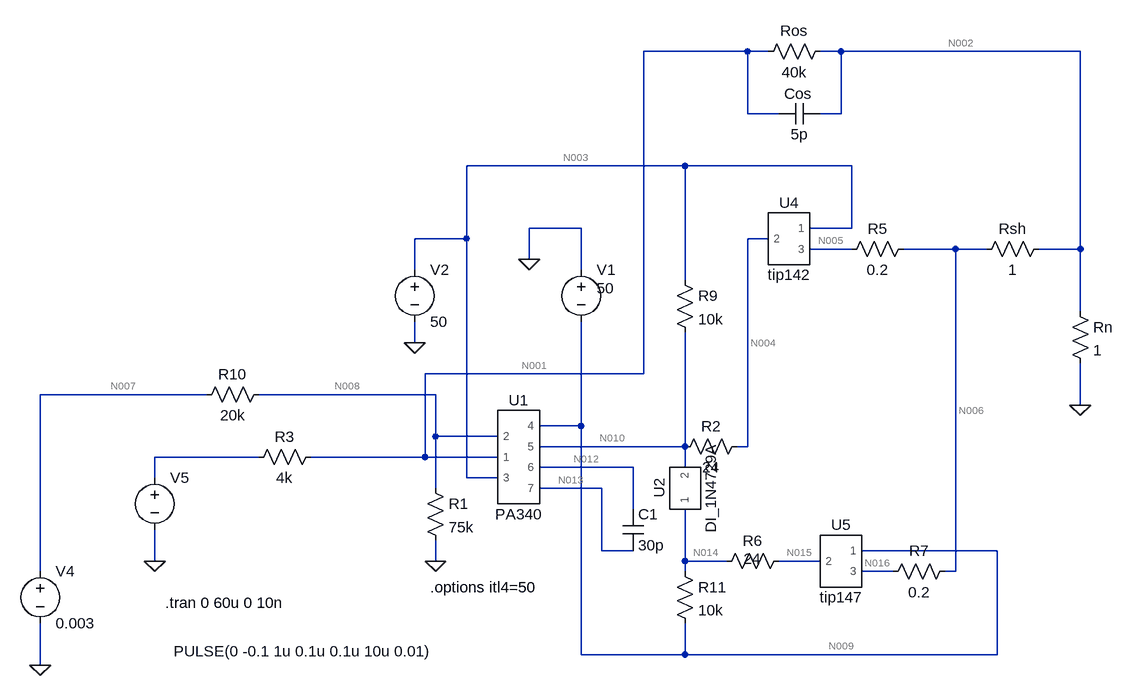
[diagram p0: schematic Draft17.asc]
Draft17.asc, the LTspice schematic file:
Version 4
SHEET 1 1672 680
WIRE 544 -464 384 -464
WIRE 576 -464 544 -464
WIRE 688 -464 656 -464
WIRE 1056 -464 688 -464
WIRE 544 -368 544 -464
WIRE 592 -368 544 -368
WIRE 688 -368 688 -464
WIRE 688 -368 656 -368
WIRE 448 -288 112 -288
WIRE 704 -288 448 -288
WIRE 288 -192 208 -192
WIRE 704 -192 704 -288
WIRE 704 -192 640 -192
WIRE 112 -176 112 -288
WIRE 112 -176 32 -176
WIRE 576 -176 544 -176
WIRE 704 -160 640 -160
WIRE 864 -160 784 -160
WIRE 912 -160 864 -160
WIRE 1056 -160 1056 -464
WIRE 1056 -160 992 -160
WIRE 208 -144 208 -192
WIRE 32 -128 32 -176
WIRE 288 -128 288 -192
WIRE 448 -112 448 -288
WIRE 1056 -64 1056 -160
WIRE 32 -16 32 -48
WIRE 384 32 384 -464
WIRE 384 32 48 32
WIRE -288 64 -544 64
WIRE 64 64 -208 64
WIRE 1056 80 1056 16
WIRE 288 112 288 -48
WIRE 288 112 224 112
WIRE 64 128 64 64
WIRE 160 128 64 128
WIRE 448 144 448 -32
WIRE 448 144 224 144
WIRE 544 144 544 -176
WIRE 544 144 528 144
WIRE -208 160 -368 160
WIRE 48 160 48 32
WIRE 48 160 -128 160
WIRE 160 160 48 160
WIRE 368 176 224 176
WIRE 448 176 448 144
WIRE -368 192 -368 160
WIRE 112 192 112 -176
WIRE 160 192 112 192
WIRE 64 208 64 128
WIRE 320 208 224 208
WIRE 368 240 368 176
WIRE 320 304 320 208
WIRE 368 304 320 304
WIRE 928 304 720 304
WIRE -368 320 -368 272
WIRE 64 320 64 288
WIRE 448 320 448 240
WIRE 512 320 448 320
WIRE 656 320 592 320
WIRE -544 336 -544 64
WIRE 448 336 448 320
WIRE 768 336 720 336
WIRE 864 336 864 -160
WIRE 864 336 848 336
WIRE 288 464 288 112
WIRE 448 464 448 416
WIRE 448 464 288 464
WIRE 928 464 928 304
WIRE 928 464 448 464
WIRE -544 480 -544 416
FLAG 32 -16 0
FLAG 208 -144 0
FLAG -544 480 0
FLAG 1056 80 0
FLAG -368 320 0
FLAG 64 320 0
SYMBOL PA340 192 160 R0
SYMATTR InstName U1
SYMBOL res 48 192 R0
SYMATTR InstName R1
SYMATTR Value 75k
SYMBOL res 544 128 R90
WINDOW 0 0 56 VBottom 2
WINDOW 3 32 56 VTop 2
SYMATTR InstName R2
SYMATTR Value 24
SYMBOL res -112 144 R90
WINDOW 0 0 56 VBottom 2
WINDOW 3 32 56 VTop 2
SYMATTR InstName R3
SYMATTR Value 4k
SYMBOL cap 352 240 R0
SYMATTR InstName C1
SYMATTR Value 30p
SYMBOL voltage 288 -144 R0
WINDOW 3 24 44 Left 2
WINDOW 123 0 0 Left 0
WINDOW 39 0 0 Left 0
SYMATTR Value 50
SYMATTR InstName V1
SYMBOL voltage 32 -144 R0
WINDOW 123 0 0 Left 0
WINDOW 39 0 0 Left 0
SYMATTR InstName V2
SYMATTR Value 50
SYMBOL res 1040 -80 R0
SYMATTR InstName Rn
SYMATTR Value 1
SYMBOL res 672 -480 R90
WINDOW 0 0 56 VBottom 2
WINDOW 3 32 56 VTop 2
SYMATTR InstName Ros
SYMATTR Value 40k
SYMBOL cap 656 -384 R90
WINDOW 0 1 34 VBottom 2
WINDOW 3 32 32 VTop 2
SYMATTR InstName Cos
SYMATTR Value 5p
SYMBOL res -192 48 R90
WINDOW 0 0 56 VBottom 2
WINDOW 3 32 56 VTop 2
SYMATTR InstName R10
SYMATTR Value 20k
SYMBOL voltage -368 176 R0
WINDOW 123 0 0 Left 0
WINDOW 39 0 0 Left 0
WINDOW 3 29 283 Left 2
SYMATTR Value PULSE(0 -0.1 1u 0.1u 0.1u 10u 0.01)
SYMATTR InstName V5
SYMBOL res 608 304 R90
WINDOW 0 0 56 VBottom 2
WINDOW 3 28 56 VBottom 2
SYMATTR InstName R6
SYMATTR Value 24
SYMBOL voltage -544 320 R0
WINDOW 123 0 0 Left 0
WINDOW 39 0 0 Left 0
SYMATTR InstName V4
SYMATTR Value 0.003
SYMBOL tip142 608 -176 R0
SYMATTR InstName U4
SYMBOL tip147 688 320 R0
SYMATTR InstName U5
SYMBOL res 800 -176 R90
WINDOW 0 0 56 VBottom 2
WINDOW 3 32 56 VTop 2
SYMATTR InstName R5
SYMATTR Value 0.2
SYMBOL res 864 320 R90
WINDOW 0 0 56 VBottom 2
WINDOW 3 32 56 VTop 2
SYMATTR InstName R7
SYMATTR Value 0.2
SYMBOL res 432 -128 R0
SYMATTR InstName R9
SYMATTR Value 10k
SYMBOL res 432 320 R0
SYMATTR InstName R11
SYMATTR Value 10k
SYMBOL DI_1N4729A 448 208 R270
SYMATTR InstName U2
SYMBOL res 1008 -176 R90
WINDOW 0 0 56 VBottom 2
WINDOW 3 32 56 VTop 2
SYMATTR InstName Rsh
SYMATTR Value 1
TEXT -352 384 Left 2 !.tran 0 60u 0 10n
TEXT 56 360 Left 2 !.options itl4=50

The netlist it stands for:
* Draft17.asc
XU1 N008 N001 N003 N009 N010 N012 N013 PA340  ; pins 2 1 3 4 5 6 7
R1 N008 0 75k
R2 N004 N010 24
R3 N001 N011 4k
C1 N012 N013 30p
V1 0 N009 50
V2 N003 0 50
Rn N002 0 1
Ros N002 N001 40k
Cos N002 N001 5p
R10 N008 N007 20k
V5 N011 0 PULSE(0 -0.1 1u 0.1u 0.1u 10u 0.01)
R6 N015 N014 24
V4 N007 0 0.003
XU4 N003 N004 N005 tip142  ; pins 1 2 3
XU5 N009 N015 N016 tip147  ; pins 1 2 3
R5 N006 N005 0.2
R7 N006 N016 0.2
R9 N003 N010 10k
R11 N014 N009 10k
XU2 N014 N010 DI_1N4729A  ; pins 1 2
Rsh N002 N006 1
.tran 0 60u 0 10n
.options itl4=50
.lib PA340_Pspice.LIB
.lib TIP142.cir
.lib TIP147.cir
.lib 1N4729A.cir
.backanno
.end

* Results of the author's LTspice run, read from the files saved beside the schematic
* Operating Point, zero values left out:
*   V(n003) = 50 V
*   V(n009) = -50 V
*   V(n012) = -1.9 mV
*   V(n013) = 2.375 V
*   V(n010) = 2.333 V
*   V(n001) = 14.39 mV
*   V(n008) = 2.368 mV
*   V(n004) = 2.321 V
*   V(n002) = 158.3 mV
*   V(n007) = 3 mV
*   V(n015) = -988.3 mV
*   V(n014) = -992.5 mV
*   V(n005) = 350.5 mV
*   V(n016) = 314.4 mV
*   V(n006) = 316.6 mV
*   I(Rsh) = -158.3 mA
*   I(R11) = 4.901 mA
*   I(R9) = 4.767 mA
*   I(R7) = 11.03 mA
*   I(R5) = -169.3 mA
*   I(R6) = 173.4 µA
*   I(R10) = -31.62 nA
*   I(Ros) = 3.598 µA
*   I(Rn) = 158.3 mA
*   I(R3) = 3.597 µA
*   I(R2) = -517.9 µA
*   I(R1) = 31.57 nA
*   I(V4) = -31.62 nA
*   I(V5) = 3.597 µA
*   I(V2) = -176 mA
*   I(V1) = -17.74 mA
*   Ix(u1:2) = 55 pA
*   Ix(u1:1) = 50 pA
*   Ix(u1:3) = 2.454 mA
*   Ix(u1:4) = -1.975 mA
*   Ix(u1:5) = -478.6 µA
*   Ix(u4:1) = 168.8 mA
*   Ix(u4:2) = 517.9 µA
*   Ix(u4:3) = -169.3 mA
*   Ix(u5:1) = -10.86 mA
*   Ix(u5:2) = -173.4 µA
*   Ix(u5:3) = 11.03 mA
*   Ix(u2:1) = -4.727 mA
*   Ix(u2:2) = 4.727 mA
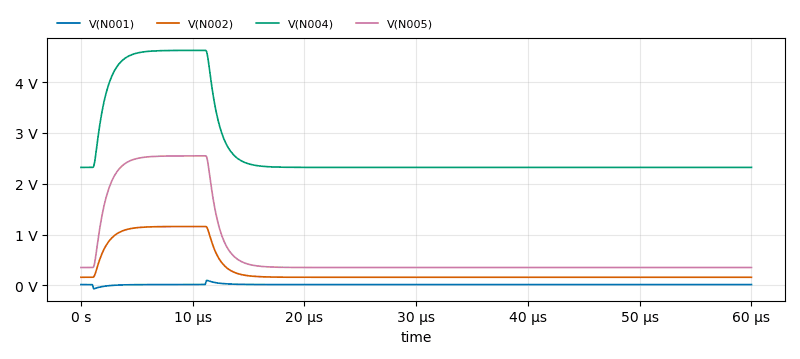
[diagram p1: Transient Analysis of Draft17.asc, plotted from the saved traces]
* Transient Analysis, 1 run:
*   V(N001): min -68.8 mV, max 97.17 mV, average 14.39 mV, rms 18.38 mV, last 14.39 mV
*   V(N002): min 158.3 mV, max 1.158 V, average 326.6 mV, rms 478.9 mV, last 158.3 mV
*   V(N004): min 2.321 V, max 4.625 V, average 2.71 V, rms 2.828 V, last 2.321 V
*   V(N005): min 350.5 mV, max 2.549 V, average 720.5 mV, rms 1.055 V, last 350.5 mV